# EAGLE design spine (EAGLE 6.5.0)

## Sheet 1 of 3: Leg COM
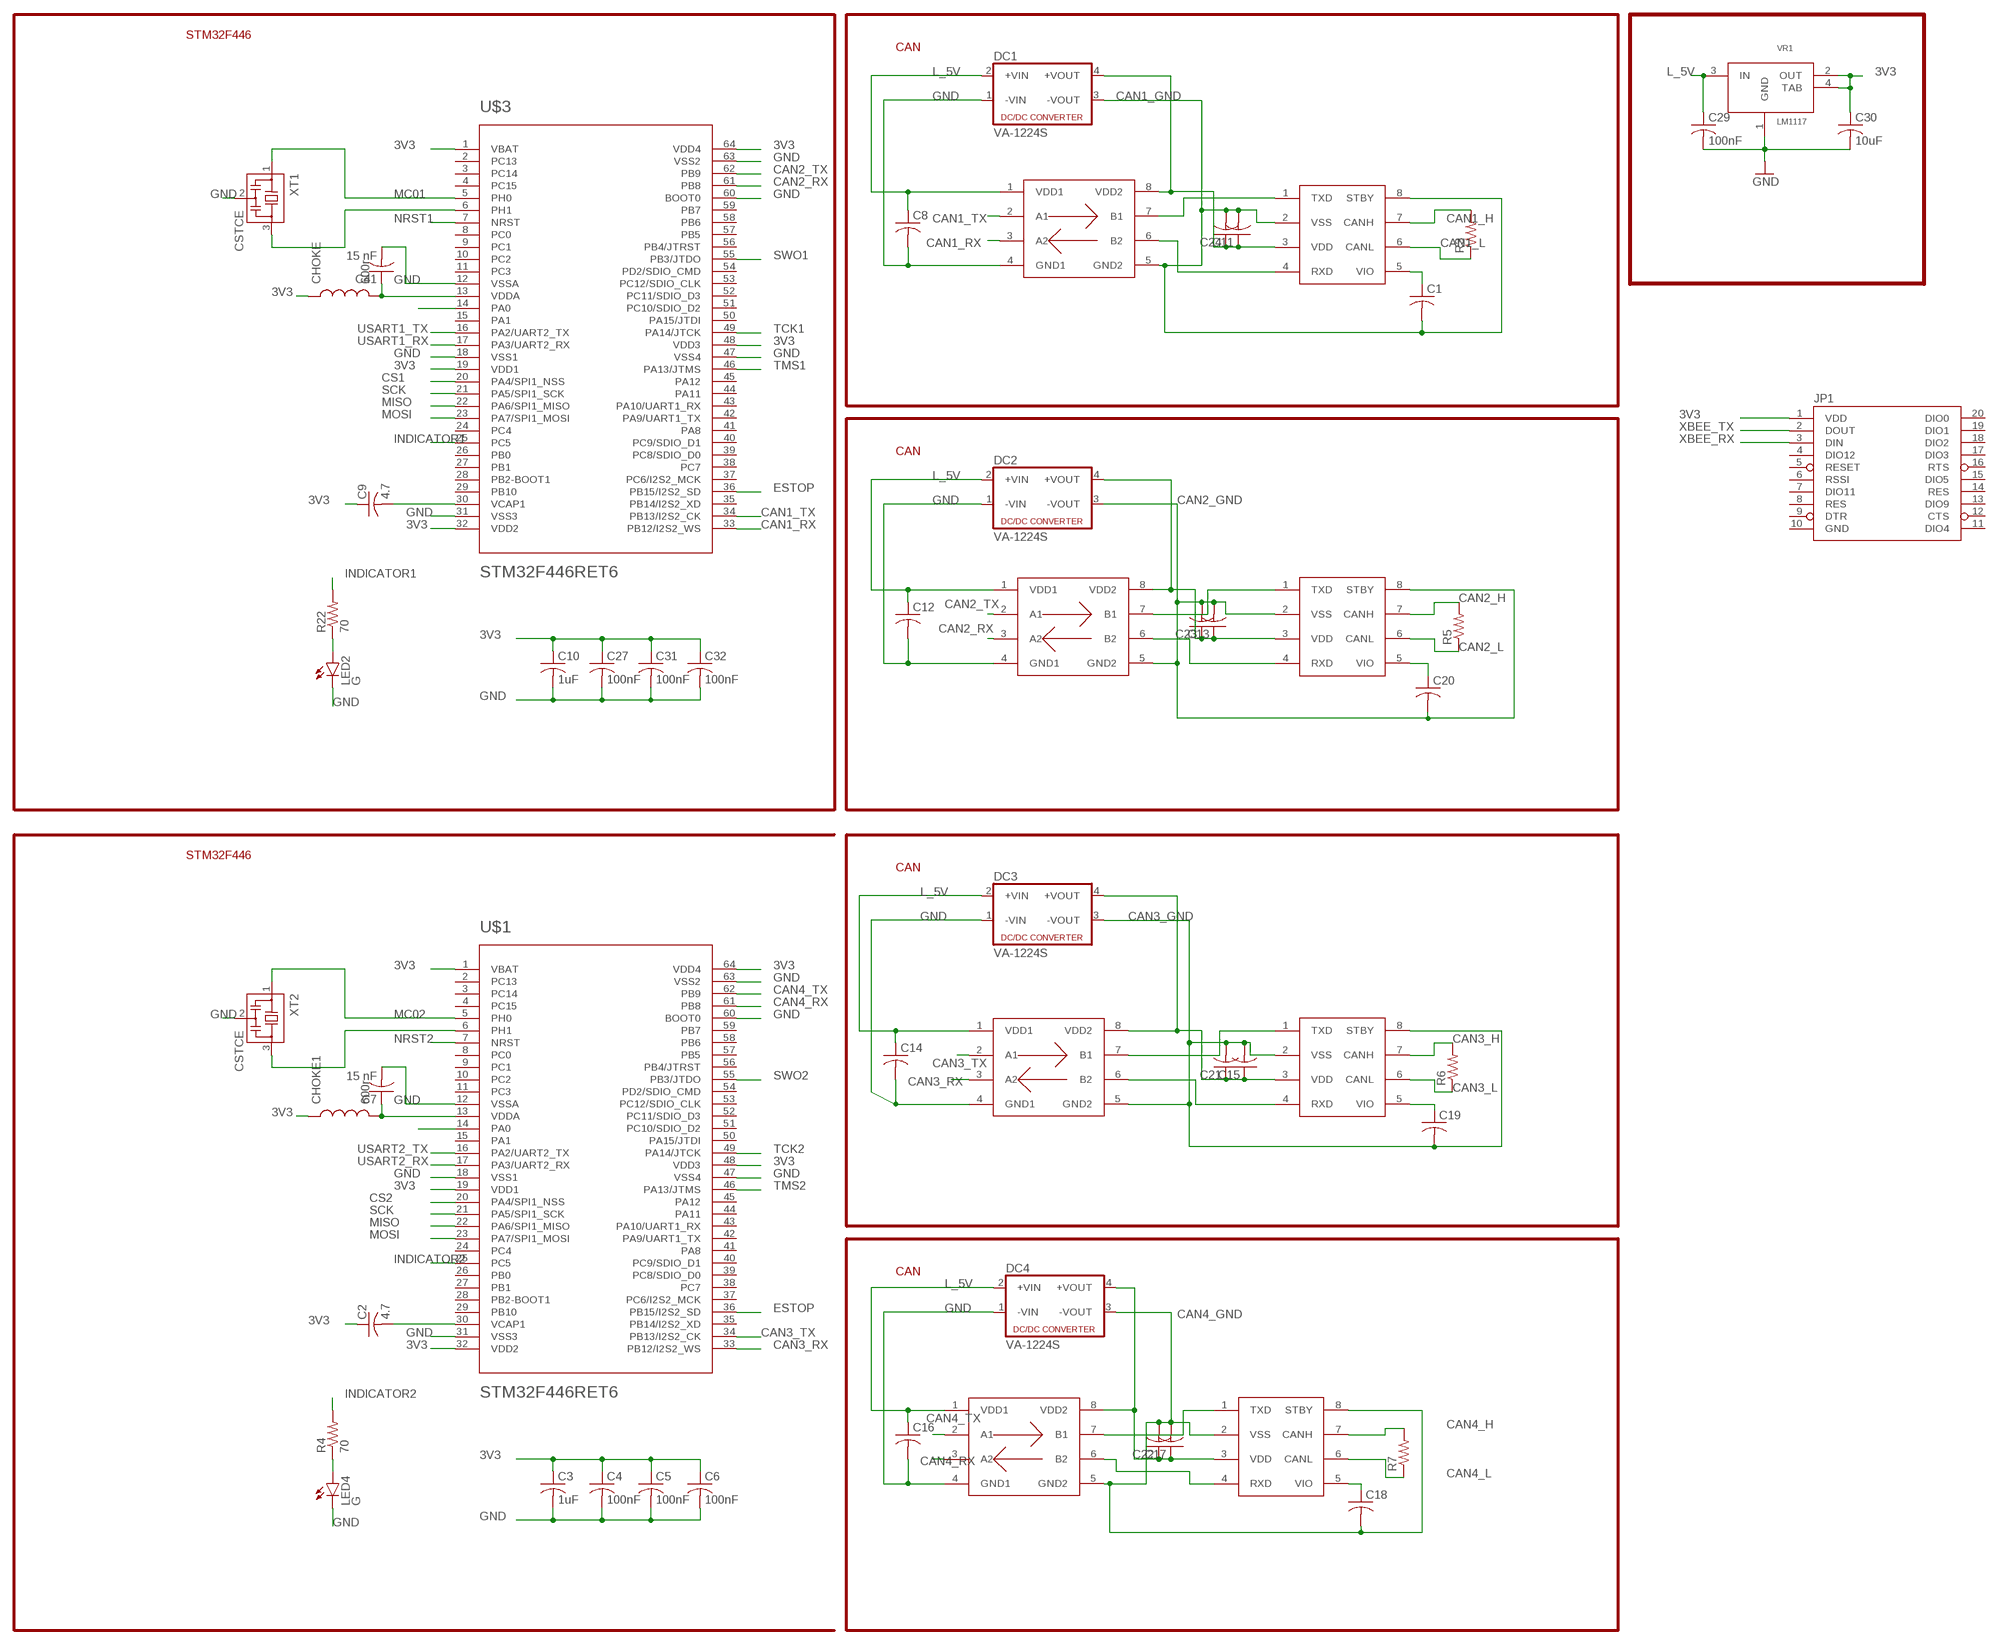
[diagram p0: schematic, sheet 1]

### Parts
C1  C-USC0603K  [C0603K]
C2  4.7  C-USC0603  [C0603]
C3  1uF  C-USC0603  [C0603]
C4  100nF  C-USC0603  [C0603]
C5  100nF  C-USC0603  [C0603]
C6  100nF  C-USC0603  [C0603]
C7  15 nF  C-USC0603  [C0603]
C8  C-USC0603K  [C0603K]
C9  4.7  C-USC0603  [C0603]
C10  1uF  C-USC0603  [C0603]
C11  C-USC0603K  [C0603K]
C12  C-USC0603K  [C0603K]
C13  C-USC0603K  [C0603K]
C14  C-USC0603K  [C0603K]
C15  C-USC0603K  [C0603K]
C16  C-USC0603K  [C0603K]
C17  C-USC0603K  [C0603K]
C18  C-USC0603K  [C0603K]
C19  C-USC0603K  [C0603K]
C20  C-USC0603K  [C0603K]
C21  C-USC0603K  [C0603K]
C22  C-USC0603K  [C0603K]
C23  C-USC0603K  [C0603K]
C24  C-USC0603K  [C0603K]
C27  100nF  C-USC0603  [C0603]
C29  100nF  C-USC0603  [C0603]
C30  10uF  C-USC0805K  [C0805K]
C31  100nF  C-USC0603  [C0603]
C32  100nF  C-USC0603  [C0603]
C41  15 nF  C-USC0603  [C0603]
CHOKE  600r  INDUCTOR0603  [0603]
CHOKE1  600r  INDUCTOR0603  [0603]
DC1  VA-1224S  [4SIL]
DC2  VA-1224S  [4SIL]
DC3  VA-1224S  [4SIL]
DC4  VA-1224S  [4SIL]
JP1  XBEE-1B1  [XBEE-1]
LED2  G  LED0603  [LED-0603]
LED4  G  LED0603  [LED-0603]
R3  R-US_R0603  [R0603]
R4  70  R-US_R0603  [R0603]
R5  R-US_R0603  [R0603]
R6  R-US_R0603  [R0603]
R7  R-US_R0603  [R0603]
R22  70  R-US_R0603  [R0603]
U$1  STM32F446RET6  [TQFP64]
U$3  STM32F446RET6  [TQFP64]
U$4  MCP2561  [SO08]
U$5  MCP2561  [SO08]
U$6  MCP2561  [SO08]
U$7  MCP2561  [SO08]
U$8  SI8410  [SO08]
U$9  SI8410  [SO08]
U$10  SI8410  [SO08]
U$11  SI8410  [SO08]
VR1  LM1117  [SOT-223]
XT1  CSTCE  [CSTCE]
XT2  CSTCE  [CSTCE]

### Nets
3V3: C2.1 C3.1 C4.1 C5.1 C6.1 C9.1 C10.1 C27.1 C30.1 C31.1 C32.1 CHOKE1.1 CHOKE.1 JP1.1(VDD) U$1.1(VBAT) U$1.19(VDD1) U$1.32(VDD2) U$1.48(VDD3) U$1.64(VDD4) U$3.1(VBAT) U$3.19(VDD1) U$3.32(VDD2) U$3.48(VDD3) U$3.64(VDD4) VR1.2(OUT) VR1.4(TAB) ; also sheet 2
CAN1_GND: C1.2 C11.2 C24.2 DC1.3(-VOUT) U$4.2(VSS) U$4.8(STBY) U$8.5(GND2) ; also sheet 2
CAN1_H: R3.2 U$4.7(CANH) ; also sheet 2
CAN1_L: R3.1 U$4.6(CANL) ; also sheet 2
CAN1_RX: U$3.33(PB12/I2S2_WS) U$8.3(A2)
CAN1_TX: U$3.34(PB13/I2S2_CK) U$8.2(A1)
CAN2_GND: C13.2 C20.2 C23.2 DC2.3(-VOUT) U$5.2(VSS) U$5.8(STBY) U$10.5(GND2) ; also sheet 2
CAN2_H: R5.2 U$5.7(CANH) ; also sheet 2
CAN2_L: R5.1 U$5.6(CANL) ; also sheet 2
CAN2_RX: U$3.61(PB8) U$10.3(A2)
CAN2_TX: U$3.62(PB9) U$10.2(A1)
CAN3_GND: C15.2 C19.2 C21.2 DC3.3(-VOUT) U$6.2(VSS) U$6.8(STBY) U$9.5(GND2) ; also sheet 2
CAN3_H: R6.2 U$6.7(CANH) ; also sheet 2
CAN3_L: R6.1 U$6.6(CANL) ; also sheet 2
CAN3_RX: U$1.33(PB12/I2S2_WS) U$9.3(A2)
CAN3_TX: U$1.34(PB13/I2S2_CK) U$9.2(A1)
CAN4_GND: C17.2 C18.2 C22.2 DC4.3(-VOUT) U$7.2(VSS) U$7.8(STBY) U$11.5(GND2) ; also sheet 2
CAN4_H: R7.2 U$7.7(CANH) ; also sheet 2
CAN4_L: R7.1 U$7.6(CANL) ; also sheet 2
CAN4_RX: U$1.61(PB8) U$11.3(A2)
CAN4_TX: U$1.62(PB9) U$11.2(A1)
CS1: U$3.20(PA4/SPI1_NSS) ; also sheet 3
CS2: U$1.20(PA4/SPI1_NSS) ; also sheet 3
ESTOP: U$1.36(PB15/I2S2_SD) U$3.36(PB15/I2S2_SD) ; also sheet 2
GND: C3.2 C4.2 C5.2 C6.2 C7.2 C8.2 C10.2 C12.2 C14.2 C16.2 C27.2 C29.2 C30.2 C31.2 C32.2 C41.2 DC1.1(-VIN) DC2.1(-VIN) DC3.1(-VIN) DC4.1(-VIN) LED2.C LED4.C U$1.12(VSSA) U$1.18(VSS1) U$1.31(VSS3) U$1.47(VSS4) U$1.60(BOOT0) U$1.63(VSS2) U$3.12(VSSA) U$3.18(VSS1) U$3.31(VSS3) U$3.47(VSS4) U$3.60(BOOT0) U$3.63(VSS2) U$8.4(GND1) U$9.4(GND1) U$10.4(GND1) U$11.4(GND1) VR1.1(GND) XT1.2 XT2.2 ; also sheet 2,3
INDICATOR1: R22.2 U$3.25(PC5)
INDICATOR2: R4.2 U$1.25(PC5)
L_5V: C8.1 C12.1 C14.1 C16.1 C29.1 DC1.2(+VIN) DC2.2(+VIN) DC3.2(+VIN) DC4.2(+VIN) U$8.1(VDD1) U$9.1(VDD1) U$10.1(VDD1) U$11.1(VDD1) VR1.3(IN) ; also sheet 2,3
MC01: U$3.5(PH0) XT1.1
MC02: U$1.5(PH0) XT2.1
MISO: U$1.22(PA6/SPI1_MISO) U$3.22(PA6/SPI1_MISO) ; also sheet 3
MOSI: U$1.23(PA7/SPI1_MOSI) U$3.23(PA7/SPI1_MOSI) ; also sheet 3
N$1: U$1.14(PA0)
N$2: C41.1 CHOKE.2 U$3.13(VDDA)
N$3: C9.2 U$3.30(VCAP1)
N$4: C7.1 CHOKE1.2 U$1.13(VDDA)
N$5: C2.2 U$1.30(VCAP1)
N$6: C1.1 U$4.5(VIO)
N$7: LED4.A R4.1
N$8: U$1.6(PH1) XT2.3
N$9: C17.1 C22.1 DC4.4(+VOUT) U$7.3(VDD) U$11.8(VDD2)
N$10: C20.1 U$5.5(VIO)
N$11: C15.1 C21.1 DC3.4(+VOUT) U$6.3(VDD) U$9.8(VDD2)
N$12: C11.1 C24.1 DC1.4(+VOUT) U$4.3(VDD) U$8.8(VDD2)
N$14: U$4.1(TXD) U$8.7(B1)
N$15: U$7.1(TXD) U$11.7(B1)
N$16: U$4.4(RXD) U$8.6(B2)
N$17: U$7.4(RXD) U$11.6(B2)
N$18: C18.1 U$7.5(VIO)
N$19: C13.1 C23.1 DC2.4(+VOUT) U$5.3(VDD) U$10.8(VDD2)
N$20: U$5.1(TXD) U$10.7(B1)
N$21: U$5.4(RXD) U$10.6(B2)
N$22: C19.1 U$6.5(VIO)
N$24: U$3.14(PA0)
N$26: U$6.1(TXD) U$9.7(B1)
N$27: U$6.4(RXD) U$9.6(B2)
N$28: LED2.A R22.1
N$30: U$3.6(PH1) XT1.3
NRST1: U$3.7(NRST) ; also sheet 2
NRST2: U$1.7(NRST) ; also sheet 2
SCK: U$1.21(PA5/SPI1_SCK) U$3.21(PA5/SPI1_SCK) ; also sheet 3
SWO1: U$3.55(PB3/JTDO) ; also sheet 2
SWO2: U$1.55(PB3/JTDO) ; also sheet 2
TCK1: U$3.49(PA14/JTCK) ; also sheet 2
TCK2: U$1.49(PA14/JTCK) ; also sheet 2
TMS1: U$3.46(PA13/JTMS) ; also sheet 2
TMS2: U$1.46(PA13/JTMS) ; also sheet 2
USART1_RX: U$3.17(PA3/UART2_RX) ; also sheet 2
USART1_TX: U$3.16(PA2/UART2_TX) ; also sheet 2
USART2_RX: U$1.17(PA3/UART2_RX) ; also sheet 2
USART2_TX: U$1.16(PA2/UART2_TX) ; also sheet 2
XBEE_RX: JP1.3(DIN) ; also sheet 3
XBEE_TX: JP1.2(DOUT) ; also sheet 3
Unconnected: JP1.4(DIO12) JP1.5(RESET) JP1.6(RSSI) JP1.7(DIO11) JP1.8(RES) JP1.9(DTR) JP1.11(DIO4) JP1.12(CTS) JP1.13(DIO9) JP1.14(RES) JP1.15(DIO5) JP1.16(RTS) JP1.17(DIO3) JP1.18(DIO2) JP1.19(DIO1) JP1.20(DIO0) U$1.2(PC13) U$1.3(PC14) U$1.4(PC15) U$1.8(PC0) U$1.9(PC1) U$1.10(PC2) U$1.11(PC3) U$1.15(PA1) U$1.24(PC4) U$1.26(PB0) U$1.27(PB1) U$1.28(PB2-BOOT1) U$1.29(PB10) U$1.35(PB14/I2S2_XD) U$1.37(PC6/I2S2_MCK) U$1.38(PC7) U$1.39(PC8/SDIO_D0) U$1.40(PC9/SDIO_D1) U$1.41(PA8) U$1.42(PA9/UART1_TX) U$1.43(PA10/UART1_RX) U$1.44(PA11) U$1.45(PA12) U$1.50(PA15/JTDI) U$1.51(PC10/SDIO_D2) U$1.52(PC11/SDIO_D3) U$1.53(PC12/SDIO_CLK) U$1.54(PD2/SDIO_CMD) U$1.56(PB4/JTRST) U$1.57(PB5) U$1.58(PB6) U$1.59(PB7) U$3.2(PC13) U$3.3(PC14) U$3.4(PC15) U$3.8(PC0) U$3.9(PC1) U$3.10(PC2) U$3.11(PC3) U$3.15(PA1) U$3.24(PC4) U$3.26(PB0) U$3.27(PB1) U$3.28(PB2-BOOT1) U$3.29(PB10) U$3.35(PB14/I2S2_XD) U$3.37(PC6/I2S2_MCK) U$3.38(PC7) U$3.39(PC8/SDIO_D0) U$3.40(PC9/SDIO_D1) U$3.41(PA8) U$3.42(PA9/UART1_TX) U$3.43(PA10/UART1_RX) U$3.44(PA11) U$3.45(PA12) U$3.50(PA15/JTDI) U$3.51(PC10/SDIO_D2) U$3.52(PC11/SDIO_D3) U$3.53(PC12/SDIO_CLK) U$3.54(PD2/SDIO_CMD) U$3.56(PB4/JTRST) U$3.57(PB5) U$3.58(PB6) U$3.59(PB7)

### Notes on the sheet
- STM32F446
- CAN
- CAN
- STM32F446
- CAN
- CAN

## Sheet 2 of 3: Connectors
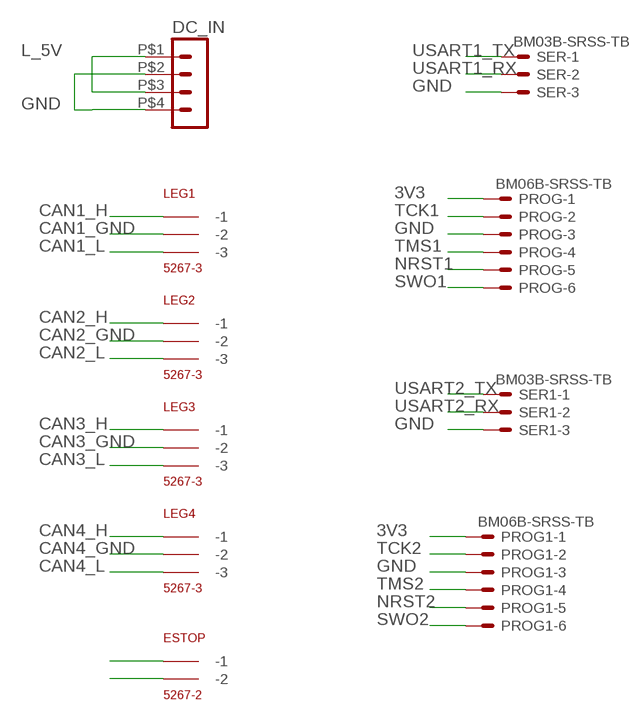
[diagram p1: schematic, sheet 2]

### Parts
DC_IN  HEADER_POS4_43045-0401  [43045-0400]
ESTOP  5267-2  [5267-2]
LEG1  5267-3  [5267-3]
LEG2  5267-3  [5267-3]
LEG3  5267-3  [5267-3]
LEG4  5267-3  [5267-3]
PROG  BM06B-SRSS-TB  [BM06B-SRSS-TB]
PROG1  BM06B-SRSS-TB  [BM06B-SRSS-TB]
SER  BM03B-SRSS-TB  [BM03B-SRSS-TB]
SER1  BM03B-SRSS-TB  [BM03B-SRSS-TB]

### Nets
3V3: PROG1.1 PROG.1 ; also sheet 1
CAN1_GND: LEG1.P$2(-2) ; also sheet 1
CAN1_H: LEG1.P$1(-1) ; also sheet 1
CAN1_L: LEG1.P$3(-3) ; also sheet 1
CAN2_GND: LEG2.P$2(-2) ; also sheet 1
CAN2_H: LEG2.P$1(-1) ; also sheet 1
CAN2_L: LEG2.P$3(-3) ; also sheet 1
CAN3_GND: LEG3.P$2(-2) ; also sheet 1
CAN3_H: LEG3.P$1(-1) ; also sheet 1
CAN3_L: LEG3.P$3(-3) ; also sheet 1
CAN4_GND: LEG4.P$2(-2) ; also sheet 1
CAN4_H: LEG4.P$1(-1) ; also sheet 1
CAN4_L: LEG4.P$3(-3) ; also sheet 1
ESTOP: ESTOP.P$2(-2) ; also sheet 1
GND: DC_IN.P$2 DC_IN.P$4 ESTOP.P$1(-1) PROG1.3 PROG.3 SER1.3 SER.3 ; also sheet 1,3
L_5V: DC_IN.P$1 DC_IN.P$3 ; also sheet 1,3
NRST1: PROG.5 ; also sheet 1
NRST2: PROG1.5 ; also sheet 1
SWO1: PROG.6 ; also sheet 1
SWO2: PROG1.6 ; also sheet 1
TCK1: PROG.2 ; also sheet 1
TCK2: PROG1.2 ; also sheet 1
TMS1: PROG.4 ; also sheet 1
TMS2: PROG1.4 ; also sheet 1
USART1_RX: SER.2 ; also sheet 1
USART1_TX: SER.1 ; also sheet 1
USART2_RX: SER1.2 ; also sheet 1
USART2_TX: SER1.1 ; also sheet 1

## Sheet 3 of 3: UP Board
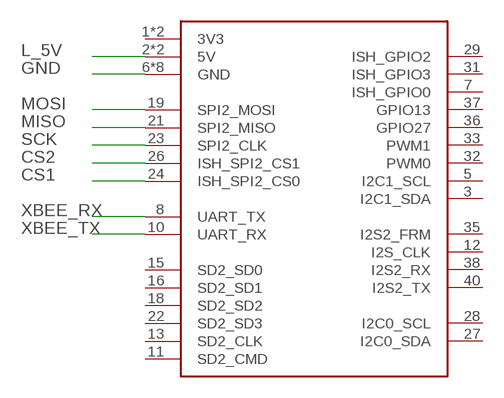
[diagram p2: schematic, sheet 3]

### Parts
U$2  UP_BOARD  [UP_BOARD]

### Nets
CS1: U$2.24(ISH_SPI2_CS0) ; also sheet 1
CS2: U$2.26(ISH_SPI2_CS1) ; also sheet 1
GND: U$2.6(GND) U$2.9(GND) U$2.14(GND) U$2.20(GND) U$2.25(GND) U$2.30(GND) U$2.34(GND) U$2.39(GND) ; also sheet 1,2
L_5V: U$2.2(5V) U$2.4(5V) ; also sheet 1,2
MISO: U$2.21(SPI2_MISO) ; also sheet 1
MOSI: U$2.19(SPI2_MOSI) ; also sheet 1
SCK: U$2.23(SPI2_CLK) ; also sheet 1
XBEE_RX: U$2.8(UART_TX) ; also sheet 1
XBEE_TX: U$2.10(UART_RX) ; also sheet 1
Unconnected: U$2.1(3V3) U$2.3(I2C1_SDA) U$2.5(I2C1_SCL) U$2.7(ISH_GPIO0) U$2.11(SD2_CMD) U$2.12(I2S_CLK) U$2.13(SD2_CLK) U$2.15(SD2_SD0) U$2.16(SD2_SD1) U$2.17(3V3) U$2.18(SD2_SD2) U$2.22(SD2_SD3) U$2.27(I2C0_SDA) U$2.28(I2C0_SCL) U$2.29(ISH_GPIO2) U$2.31(ISH_GPIO3) U$2.32(PWM0) U$2.33(PWM1) U$2.35(I2S2_FRM) U$2.36(GPIO27) U$2.37(GPIO13) U$2.38(I2S2_RX) U$2.40(I2S2_TX)

## Power pins joined to a net without a drawn wire
GND: JP1.10(GND)

## Library data of the parts
C1-C24 C27 C29-C32 C41 = rcl:C-US: CAPACITOR, American symbol
CHOKE CHOKE1 = SparkFun-Passives:INDUCTOR: Inductors Basic Inductor/Choke - 0603 and 1206. Footprints are not proven and vary greatly between part numbers. INDUCTOR POWER 3.3UH 4.0A SMD 0.197" L x 0.197" W x 0.177" H (5.00mm x 5.00mm x 4.50mm)
DC1-DC4 = dc-dc-converter:VA-*?: DC DC Converter Single Output, 1 Watt Motien Technology Co.,Ltd. Source: va-serie.pdf
DC_IN = con-molex-micro-fit-3_0:HEADER_POS4_?: Molex - Micro-Fit 3.0 Series connector, 3.00mm (0.118") pitch header, 4 positions.
ESTOP = con-molex-spox:5267-2
JP1 = SparkFun-RF:XBEE-1: Xbee module footprints
LED2 LED4 = SparkFun-LED:LED: LEDs Standard schematic elements and footprints for 5mm, 3mm, 1206, and 0603 sized LEDs. 5mm - Spark Fun Electronics SKU : COM-00529 (and others)
LEG1-LEG4 = con-molex-spox:5267-3
PROG PROG1 = con-jst2:?M06B-SRSS-TB: Disconnectable Crimp style connector, 1.0mm pitch 6 contacts
R3-R7 R22 = rcl:R-US_: RESISTOR, American symbol
SER SER1 = con-jst2:?M03B-SRSS-TB: Disconnectable Crimp style connector, 1.0mm pitch 3 contacts
U$1 U$3 = BenLibrary:STM32F446RET6: ARM DSP Chip used on the WAV Trigger board.
U$2 = BenLibrary:UP_BOARD
U$4-U$7 = BenLibrary:MCP2561
U$8-U$11 = BenLibrary:SI8410
VR1 = sc_usercreated:LM1117
XT1 XT2 = sc_usercreated:CSTCE

## Board
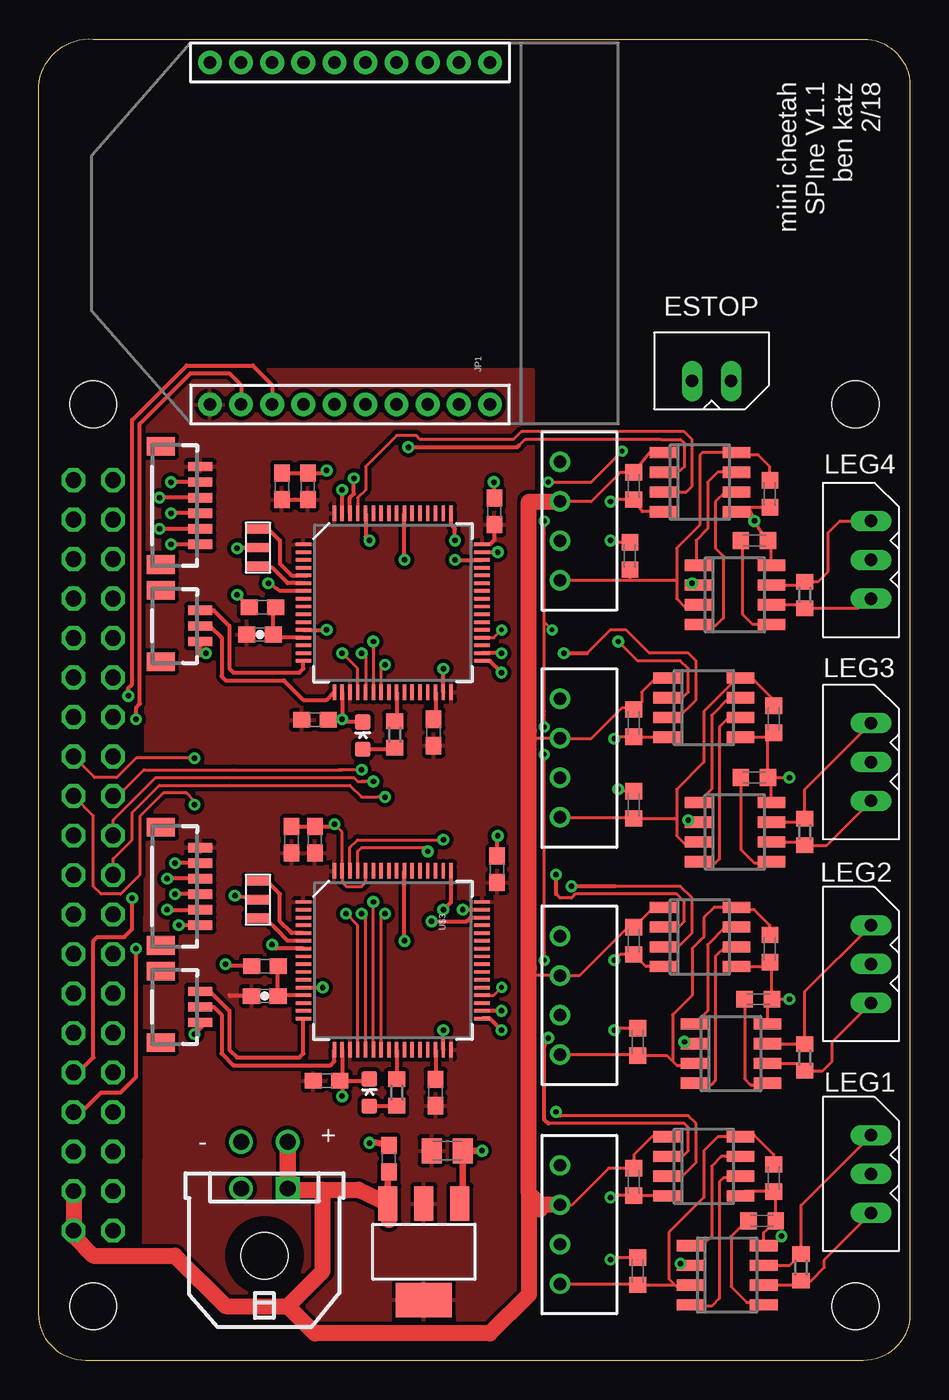
[diagram p3: board, top side]
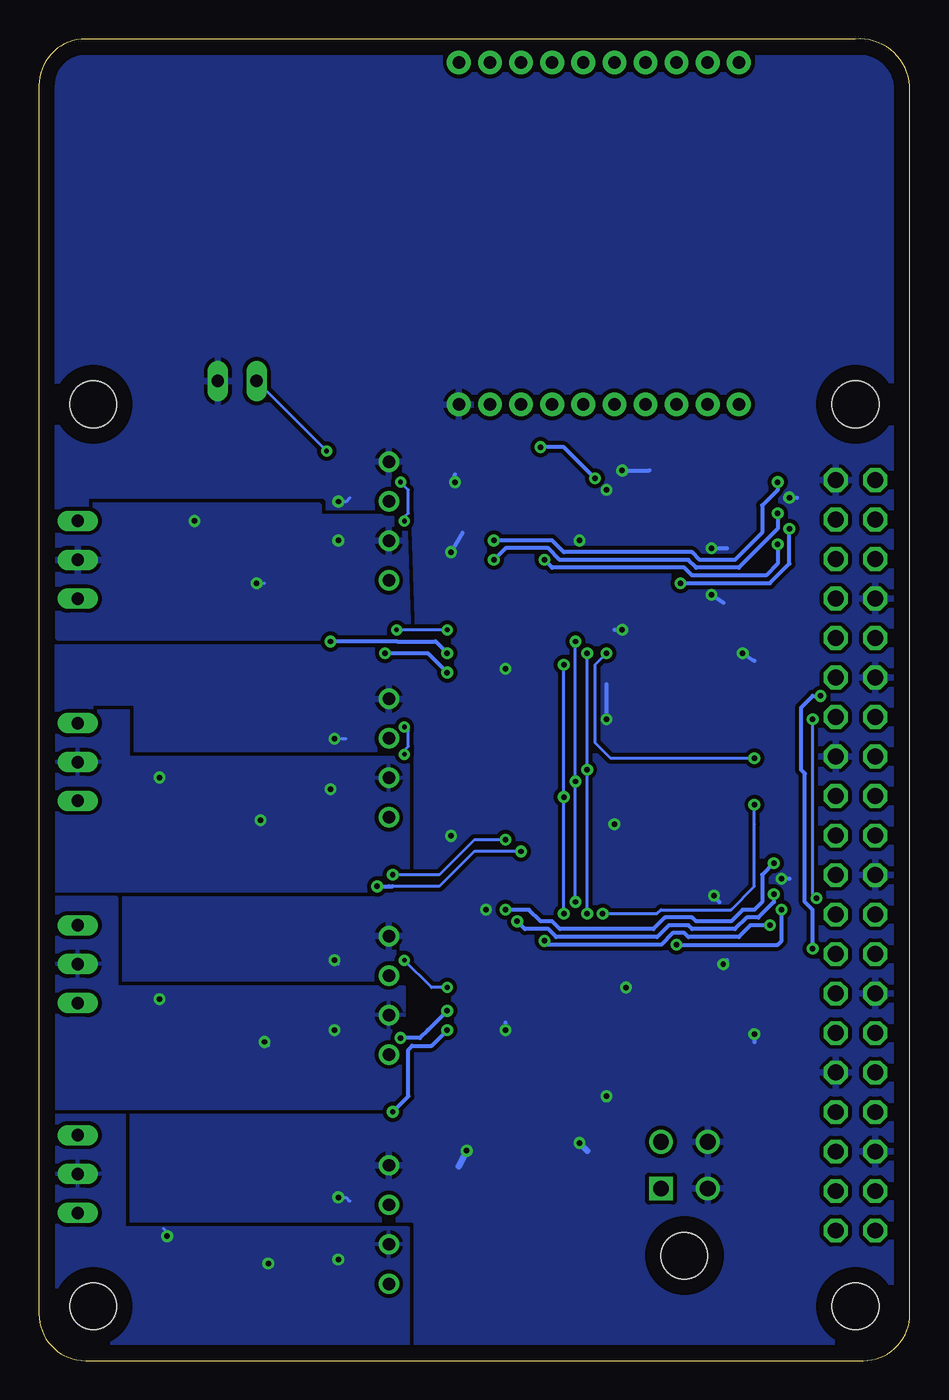
[diagram p4: board, bottom side, seen from below]

Size 56 x 85.01 mm. Coordinates in mm from the lower left corner, seen from the top.
Copper layers (1*16): Top 0.035mm / dielectric 1.5mm / Bottom 0.035mm
Design rules "default *": minimum track width 6mil, minimum drill 0.3mm, track to track 6mil, track to pad 6mil, pad to pad 6mil, via to via 6mil, smd to smd 6mil, copper to edge 40mil, drill to drill 6mil, minimum pad ring 10mil, minimum via ring 8mil, stop-mask expansion 4mil, vias tented up to drill 0mil, thermal gap 10mil

### Footprints (pad centres in the part's own frame; a part is rotated, then mirrored left to right if it is on the bottom)
C0603K = smd 1.05 x 1.08: 1 -0.875,0; 2 0.875,0
C0603 = smd 1.1 x 1: 1 -0.85,0; 2 0.85,0
C0805K = smd 1.3 x 1.6: 1 -1,0; 2 1,0
0603 = smd 1.1 x 1: 1 -0.85,0; 2 0.85,0
4SIL = drill 0.8: 1 -3.81,0; 2 -1.27,0; 3 1.27,0; 4 3.81,0
43045-0400 = drill 1.02 square: P$1 1.5,4.32 | drill 1.02: P$2 -1.5,4.32; P$3 1.5,7.32; P$4 -1.5,7.32 | hole 3: 0,0
5267-2 = drill 0.8 long: P$1 0,0; P$2 2.5,0
XBEE-1 = drill 0.8 pad 1.524: 1 -11,20; 2 -11,18; 3 -11,16; 4 -11,14; 5 -11,12; 6 -11,10; 7 -11,8; 8 -11,6; 9 -11,4; 10 -11,2; 11 11,2; 12 11,4; 13 11,6; 14 11,8; 15 11,10; 16 11,12; 17 11,14; 18 11,16; 19 11,18; 20 11,20
LED-0603 = smd 1 x 1: A 0,-0.877; C 0,0.877
5267-3 = drill 0.8 long: P$1 0,0; P$2 2.5,0; P$3 5,0
BM06B-SRSS-TB = smd 0.6 x 1.55: 1 2.5,-1.625; 2 1.5,-1.625; 3 0.5,-1.625; 4 -0.5,-1.625; 5 -1.5,-1.625; 6 -2.5,-1.625 | smd 1.2 x 1.8: FIT@1 3.8,0.9; FIT@2 -3.8,0.9
R0603 = smd 1 x 1.1: 1 -0.85,0; 2 0.85,0
BM03B-SRSS-TB = smd 0.6 x 1.55: 1 1,-1.625; 2 0,-1.625; 3 -1,-1.625 | smd 1.2 x 1.8: FIT@1 2.3,0.9; FIT@2 -2.3,0.9
TQFP64 = smd 0.22 x 1: 1 -3.75,-5.75; 2 -3.25,-5.75; 3 -2.75,-5.75; 4 -2.25,-5.75; 5 -1.75,-5.75; 6 -1.25,-5.75; 7 -0.75,-5.75; 8 -0.25,-5.75; 9 0.25,-5.75; 10 0.75,-5.75; 11 1.25,-5.75; 12 1.75,-5.75; 13 2.25,-5.75; 14 2.75,-5.75; 15 3.25,-5.75; 16 3.75,-5.75; 33 3.75,5.75; 34 3.25,5.75; 35 2.75,5.75; 36 2.25,5.75; 37 1.75,5.75; 38 1.25,5.75; 39 0.75,5.75; 40 0.25,5.75; 41 -0.25,5.75; 42 -0.75,5.75; 43 -1.25,5.75; 44 -1.75,5.75; 45 -2.25,5.75; 46 -2.75,5.75; 47 -3.25,5.75; 48 -3.75,5.75 | smd 1 x 0.22: 17 5.75,-3.75; 18 5.75,-3.25; 19 5.75,-2.75; 20 5.75,-2.25; 21 5.75,-1.75; 22 5.75,-1.25; 23 5.75,-0.75; 24 5.75,-0.25; 25 5.75,0.25; 26 5.75,0.75; 27 5.75,1.25; 28 5.75,1.75; 29 5.75,2.25; 30 5.75,2.75; 31 5.75,3.25; 32 5.75,3.75; 49 -5.75,3.75; 50 -5.75,3.25; 51 -5.75,2.75; 52 -5.75,2.25; 53 -5.75,1.75; 54 -5.75,1.25; 55 -5.75,0.75; 56 -5.75,0.25; 57 -5.75,-0.25; 58 -5.75,-0.75; 59 -5.75,-1.25; 60 -5.75,-1.75; 61 -5.75,-2.25; 62 -5.75,-2.75; 63 -5.75,-3.25; 64 -5.75,-3.75
UP_BOARD = drill 1.016 octagon: 1 8.37,51.23; 2 8.37,53.77; 3 10.91,51.23; 4 10.91,53.77; 5 13.45,51.23; 6 13.45,53.77; 7 15.99,51.23; 8 15.99,53.77; 9 18.53,51.23; 10 18.53,53.77; 11 21.07,51.23; 12 21.07,53.77; 13 23.61,51.23; 14 23.61,53.77; 15 26.15,51.23; 16 26.15,53.77; 17 28.69,51.23; 18 28.69,53.77; 19 31.23,51.23; 20 31.23,53.77; 21 33.77,51.23; 22 33.77,53.77; 23 36.31,51.23; 24 36.31,53.77; 25 38.85,51.23; 26 38.85,53.77; 27 41.39,51.23; 28 41.39,53.77; 29 43.93,51.23; 30 43.93,53.77; 31 46.47,51.23; 32 46.47,53.77; 33 49.01,51.23; 34 49.01,53.77; 35 51.55,51.23; 36 51.55,53.77; 37 54.09,51.23; 38 54.09,53.77; 39 56.63,51.23; 40 56.63,53.77 | hole 3: 3.5,52.5; 61.5,52.5; 61.5,3.5; 3.5,3.5
SO08 = smd 0.72 x 1.78: 1 -1.905,-2.35; 2 -0.635,-2.35; 3 0.635,-2.35; 4 1.905,-2.35; 5 1.905,2.35; 6 0.635,2.35; 7 -0.635,2.35; 8 -1.905,2.35
SOT-223 = smd 1.219 x 2.235: 1 -2.311,-3.099; 2 0,-3.099; 3 2.311,-3.099 | smd 3.6 x 2.2: 4 0,3.099
CSTCE = smd 0.6 x 1.6: 1 -1.2,0; 2 0,0; 3 1.2,0

### Placement (x,y rotation side)
C1  46.5,9 0 top
C2  25.38,40.4 90 top
C3  15.63,56.23 90 top
C4  17.29,56.24 90 top
C5  29.29,54.62 90 top
C6  17.75,41.21 0 top
C7  14.37,48.46 180 top
C8  38.25,11.5 270 top
C9  25.5,17.25 90 top
C10  16.25,33.5 90 top
C11  38.5,5.75 90 top
C12  38.25,27 270 top
C13  38.5,20.5 90 top
C14  38.25,41 270 top
C15  38.25,35.75 90 top
C16  38.25,56.25 270 top
C17  38,51.75 90 top
C18  46,52.75 0 top
C19  46,37.5 0 top
C20  46.25,23.25 0 top
C21  47.25,41.25 270 top
C22  47,55.75 270 top
C23  47,26.5 270 top
C24  47.25,11.75 270 top
C27  17.75,33.5 90 top
C29  22.5,13 90 top
C30  26.25,13.5 0 top
C31  29.46,31.6 90 top
C32  18.5,18 0 top
C41  14.53,25.38 180 top
CHOKE  14.52,23.45 0 top
CHOKE1  14.21,46.7 0 top
DC1  33.5,8.75 270 top
DC2  33.5,23.5 270 top
DC3  33.5,38.75 270 top
DC4  33.5,54 270 top
DC_IN  14.5,6.75 0 top
ESTOP  44.5,63 180 top
JP1  31,72.5 90 top
LED2  21.25,17.25 0 top
LED4  20.83,40.2 0 top
LEG1  53.5,14.5 270 top
LEG2  53.5,28 270 top
LEG3  53.5,41 270 top
LEG4  53.5,54 270 top
PROG  8.75,30.5 90 top
PROG1  8.75,55 90 top
R3  49,6 90 top
R4  22.88,40.26 90 top
R5  49.25,19.5 90 top
R6  49.25,34 90 top
R7  49.25,49.25 90 top
R22  23,17.25 90 top
SER  8.75,22.75 90 top
SER1  8.75,47.25 90 top
U$1  22.75,48.75 270 top
U$2  56,0 90 top
U$3  22.75,25.75 270 top
U$4  44.25,5.5 270 top
U$5  44.5,19.75 270 top
U$6  44.75,34 270 top
U$7  44.75,49.25 270 top
U$8  42.75,12.5 270 top
U$9  42.75,42 270 top
U$10  42.5,27.25 270 top
U$11  42.5,56.5 270 top
VR1  24.75,7 180 top
XT1  14.09,29.65 270 top
XT2  14.09,52.29 270 top

### Tracks (layer width: path | path; a pad name or v marks a point on that pad's centre or on a via)
3V3
  Top 0.25: C3.1 C4.1 | C5.1 29.29,52.79 29,52.5 U$1.48 | CHOKE.1 12.3,23.45 12.25,23.5
  pour Top (isolate 0.25): 7,63.75 31.75,63.75 31.75,1.25 6.75,1.25
CAN1_GND  (via drill 0.35)
  Top 0.2: U$8.5 45.38,10.88 C24.2 47.38,10.75 C1.2 46.6,8.22 U$4.8 47.16,7.41 v47.75,8 | U$4.2 41.37,6.13 v41.25,6.25 | C11.2 36.88,6.62 v36.75,6.5
  Bottom 0.2: v47.75,8 47.75,8.25 48,8.5 | v41.25,6.25 41,6.25 | v36.75,6.5 36.5,6.5
  pour Bottom (isolate 0.254): 32.25,8.5 50.5,8.5 50.5,15.75 55,15.75 55,1 32.25,1
CAN1_H
  Top 0.2: U$4.7 48.28,6.13 R3.2 49,10 LEG1.P$1
CAN1_L
  Top 0.2: U$4.6 48.72,4.87 R3.1 49.65,5.15 50.5,6 50.5,6.5 LEG1.P$3
CAN1_RX  (via drill 0.35)
  Top 0.2: U$8.3 41.37,11.87 42.25,12.75 42.25,15.25 41.75,15.75 33.5,15.75 v33.25,16
  Top 0.25: 33.5,15.75 v33.25,16 | v29.75,21.25 29,22 U$3.33
  Bottom 0.25: v33.25,16 32.25,17 32.25,20 32,20.25 30.75,20.25 v29.75,21.25
CAN1_TX  (via drill 0.35)
  Top 0.2: U$8.2 41.38,13.13 41.75,13.5 41.75,15 41.5,15.25 32.75,15.25
  Top 0.25: 32.75,15.25 32.5,15.5 32.5,20.25 v32.75,20.75 | v29.75,22.5 U$3.34
  Bottom 0.25: v29.75,22.5 31,21.25 31.5,20.75 v32.75,20.75
CAN2_GND  (via drill 0.35)
  Top 0.2: C13.2 37.12,21.38 v37,21.25 | U$5.2 41.62,20.39 v41.5,20.5 | U$10.5 46.72,25.34 C23.2 47.12,25.5 C20.2 46.85,22.98 U$5.8 46.85,23.1 47,23.25 v48.25,23.25
  Bottom 0.2: v37,21.25 37,21.5 | v41.5,20.5 41.25,20.25 | v48.25,23.25 48.5,23.25
  pour Bottom (isolate 0.254): 32.5,24 51,24 51,29.75 55,29.75 55,16.25 32.5,16.25
CAN2_H
  Top 0.2: U$5.7 49.22,20.39 R5.2 49.25,23.75 LEG2.P$1
CAN2_L
  Top 0.2: U$5.6 48.78,19.11 R5.1 50.4,18.65 51,19.25 51,20.5 LEG2.P$3
CAN2_RX  (via drill 0.35)
  Top 0.2: U$3.61 20.5,32.5 20.5,32.75 20.75,33 24.75,33 v25,32.75 | U$10.3 41.12,26.61 42,27.5 42,29.75 41.25,30.5 37,30.5
  Top 0.25: 37,30.5 v34.25,30.5
  Bottom 0.2: v25,32.75 28,32.75 30.25,30.5 33.25,30.5
  Bottom 0.25: v34.25,30.5 33.5,30.5 33.25,30.5
CAN2_TX  (via drill 0.35)
  Top 0.2: U$3.62 20,33 20.5,33.5 v26,33.5 | U$10.2 41.13,27.89 41.5,28.25 41.5,29.5 41,30 34.5,30 34.25,29.75 33.5,29.75 33.25,30
  Top 0.25: 33.25,30 v33.25,31.25
  Bottom 0.2: v26,33.5 28,33.5 30.25,31.25 v33.25,31.25
CAN3_GND  (via drill 0.35)
  Top 0.2: U$9.5 46.75,40.09 | 46.75,40.09 46.97,40.09 C21.2 | 46.75,40.09 46.88,39.97 C19.2 47.1,37.27 U$6.8 47.1,37.35 47.25,37.5 v48.25,37.5 | C15.2 37.38,36.62 v37.25,36.75 | 41.87,34.63 U$6.2 41.87,34.63 | 41.87,34.63 v41.75,34.75 41.87,34.63
  Bottom 0.2: v37.25,36.75 37,36.75 | v41.75,34.75 41.5,34.75 | v48.25,37.5 48.5,37.5
  pour Bottom (isolate 0.254): 32.25,38.75 50.25,38.75 50.25,41.75 55,41.75 55,30.25 32.25,30.25
CAN3_H
  Top 0.2: U$6.7 49.03,34.63 R6.2 49.25,36.75 LEG3.P$1
CAN3_L
  Top 0.2: U$6.6 49.03,33.37 R6.1 50.65,33.15 LEG3.P$3
CAN3_RX  (via drill 0.35)
  Top 0.2: U$9.3 41.12,41.37 42.25,42.5 42.25,45 41.75,45.5 39.25,45.5 37.75,47 36.75,47 35.25,45.5
  Top 0.25: v29.75,44.25 29,45 U$1.33 | v33.75,45.5 35.25,45.5
  Bottom 0.25: v33.75,45.5 32.25,45.5 31,45.5 v29.75,44.25
CAN3_TX  (via drill 0.35)
  Top 0.2: U$9.2 41.38,42.63 41.75,43 41.75,44.5 41.25,45 38.5,45 v37.25,46.25
  Top 0.25: v29.75,45.5 U$1.34
  Bottom 0.25: v37.25,46.25 33,46.25 30.5,46.25 v29.75,45.5
CAN4_GND  (via drill 0.35)
  Top 0.2: U$11.5 45.16,54.59 v46,54 | U$7.8 47.1,52.27 C18.2 46.38,53.38 v46,54 | C22.2 45.62,54.88 v46,54 | U$7.2 42.12,49.88 v42,50 | C17.2 36.88,52.62 v36.75,52.75
  Bottom 0.2: v46,54 46.25,54 | v42,50 41.5,50 | v36.75,52.75 36.5,52.75
  pour Bottom (isolate 0.254): 32.5,54.25 38,54.25 38,55 55,55 54.75,46.5 32.25,46.5
CAN4_H
  Top 0.2: U$7.7 49.28,49.88 R7.2 50.1,50.1 50.75,50.75 50.75,53.25 51.5,54 LEG4.P$1
CAN4_L
  Top 0.2: U$7.6 48.78,48.62 R7.1 52.65,48.4 LEG4.P$3
CAN4_RX
  Top 0.2: U$11.3 41.62,55.87 42,56.25 42,59.25 41.5,59.75 31,59.75 30.5,59.25 24.5,59.25 24.25,59.5 23,59.5 21,57.5 21,56 20.5,55.5 U$1.61
CAN4_TX  (via drill 0.35)
  Top 0.2: 30.88,58.88 31.25,59.25 40,59.25 41.25,59.25 41.5,59 41.5,57.5 41.25,57.25 40.27,57.25 U$11.2
  Top 0.25: U$1.62 20,55.5 20.25,55.75 v20.25,56.75 | v23.75,58.75 30.75,58.75 30.88,58.88
  Bottom 0.25: v20.25,56.75 22.25,58.75 v23.75,58.75
CS1  (via drill 0.35)
  Top 0.2: U$3.20 20.5,28 v19.75,28.75 | v10,35.75 10,36 9.5,36.5 8,36.5 6.5,35 6.5,31.25 5.25,30 4,30 3.5,30.5 3.5,35.04 U$2.24
  Bottom 0.2: v19.75,28.75 16.25,28.75 16,29 11.5,29 10,30.5 10,34.5 v10,35.75
CS2  (via drill 0.35)
  Top 0.2: U$1.20 20.5,44.5 v19.5,45.5 | v10,38.75 6.25,38.75 5,37.5 3.58,37.5 U$2.26
  Bottom 0.2: v19.5,45.5 20.25,44.75 20.25,39.75 19.25,38.75 v10,38.75
  Bottom 0.25: U$2.26 2.23,38.77
ESTOP  (via drill 0.3)
  Top 0.2: U$3.36 29.25,23.5 v29.75,24 | v32.5,25.75 32.5,26 32.5,26.25 v32.5,39 32.5,38.75 | v32.5,40.75 32.5,41.5 32.5,41.75 32.5,47.5 | 32.5,47.5 32.5,53.25 v32.5,54 | v32.75,56.5 35.5,56.5 v37.5,58.5 | U$1.36 29.25,46.5 | 29.25,46.5 v29.75,47 29.25,46.5 | v33,47 32.5,47.5
  Bottom 0.2: v29.75,24 30.75,24 v32.5,25.75 | v32.5,39 32.5,39.25 32.25,39.5 32.25,40.5 v32.5,40.75 | v32.5,54 32.5,54.25 32.25,54.5 32.25,56 v32.75,56.5 | v37.5,58.5 ESTOP.P$2 | v29.75,47 v33,47
GND  (via drill 0.35)
  Top 0.2: v19,34.5 19.5,34 U$3.63 19.5,30.75 19.75,30.5 20.75,30.5 21,30.75 U$3.60 | U$11.4 38.78,54.59 C16.2 36.88,55.38 v36.75,55.25 | U$9.4 40.37,40.12 C14.2 37.12,40.12 v37,40 | U$10.4 39.03,25.34 C12.2 37.38,26.12 v37,25.75 | U$8.4 40.37,10.62 C8.2 36.88,10.62 v36.75,10.5
  Top 0.25: U$1.47 v29.5,52 | U$1.63 v19.5,56 | C3.2 17.53,57.08 C4.2 18.16,57.09 v18.5,57.25 | C5.2 29.29,56.46 v29.25,56.5 | U$1.12 v18.5,47 | C7.2 13.54,48.46 v12.75,49.25 | XT2.2 13.54,52.29 13.5,52.25 v12.75,52.25 | v19.5,41.25 U$1.18 19.5,41.11 C6.2 19.48,41.08 LED4.C | U$1.31 v26,44.5 | v19.5,17 U$3.18 19.5,18.15 C32.2 21.12,18 LED2.C | U$3.31 v26,21.25 | U$3.12 v18.25,24 | U$3.47 v27.25,29 | C31.2 29.46,33.71 v29.5,33.75 | C10.2 C27.2 18.85,34.35 v19,34.5 | C41.2 12.12,25.38 v12,25.5 | XT1.2 v12.6,29.9 12.75,29.75 | U$1.60 21,53 v21.25,52.75 | SER.3 10.5,21.75 10.5,21.5 v10,21 | SER1.3 10.38,45.38 v10.75,45.5 | PROG1.3 v7.75,55.5 | PROG.3 v8.25,31
  Top 0.406: C29.2 21.35,14.1 v21.25,14 | v28.5,13.5 28.25,13.5 C30.2 27.25,9.29 VR1.1
  Bottom 0.2: v36.75,55.25 36.25,55.25 36,55.5 | v37,40 36.25,40 | v37,25.75 36.75,25.5 | v36.75,10.5 36.25,10.5 36,10.25
  Bottom 0.25: v29.5,52 28.75,53.25 | v18.5,57.25 16.75,57.25 | v29.25,56.5 29.25,57 | v18.5,47 19,47 | v12.75,49.25 12,48.75 | v12.75,52.25 11.75,52.25 | v19.5,41.25 19.5,43.5 | v26,21.25 26,21.75 | v18.25,24 18.5,24 | v27.25,29 27,29 | v29.5,33.75 29.5,34 | v19,34.5 19,34.75 | v12,25.5 11.75,25.75 | v12.6,29.9 12.25,29.5 | v21.25,52.75 21.25,52.5 | v10,21 10,20.5 | v10.75,45.5 10,45 | v7.75,55.5 7.25,55.5 | v8.25,31 7.75,31
  Bottom 0.406: v21.25,14 20.75,13.5 | v28.5,13.5 29,12.5
  pour Bottom (isolate 0.254, rank 3): 0,85 56,85 56,0 0,0
INDICATOR1
  Top 0.25: U$3.25 R22.2
INDICATOR2
  Top 0.25: U$1.25 23,41.23 R4.2
L_5V
  Top 0.2: U$11.1 39.28,58.41 C16.1 37.38,57.12 35.5,55.25 33.52,55.25 DC4.2 | U$9.1 39.66,43.91 38.75,43 38.75,42.38 C14.1 38.12,42 37.5,42 35.52,40.02 DC3.2 31.98,40.02 31.5,40.5 | U$10.1 39.53,29.16 C12.1 37.88,27.88 34.75,24.75 33.52,24.75 DC2.2 31.52,24.77 | U$8.1 39.41,14.4 38.25,13.25 C8.1 36.62,12.38 34.25,10 33.52,10 DC1.2
  Top 0.25: 31.52,24.77 31.5,25.25
  Top 0.406: C29.1 22.25,9.29 VR1.3 | DC_IN.P$1 DC_IN.P$3
  Top 1.016: DC1.2 32.52,10.02 32.23,10.02 | 22.5,9.04 VR1.3 20.54,11 18.25,11 | DC_IN.P$1 16,14.25 16,11 18.25,11 | 32.23,10.02 31.5,10.75 | 31.5,10.75 31.5,25.25 31.5,40 31.5,40.5 31.5,55 | 31.5,55 31.5,55.25 | 31.5,55.25 31.5,55 | 31.5,55 31.5,55.25 | 31.5,55.25 33.48,55.25 DC4.2 | 32.23,10.02 32.23,9.73 | U$2.2 U$2.4 2.23,8.02 3.5,6.75 8.75,6.75 12,3.5 16,3.5 | 16,3.5 18.25,5.75 18.25,11 | 31.5,10.75 31.5,4.25 29,1.75 17.75,1.75 16,3.5
MC01
  Top 0.25: U$3.5 16.25,27.5 15.5,28.25 15.5,30 14.5,31 13.69,30.75 XT1.1
MC02
  Top 0.25: 17.25,50.5 U$1.5 16.25,50.5 15.5,51.25 15.5,52.75 14.76,53.49 XT2.1
MISO  (via drill 0.35)
  Top 0.2: U$3.22 v21.5,29.5 | v21.5,46.25 U$1.22 | U$2.21 4.77,34.77 7.5,37.5 12.25,37.5 20.25,37.5 20.5,37.25 20.75,37.25 | 20.75,37.25 21,37.25 | v21.5,37.25 20.75,37.25
  Bottom 0.2: v21.5,29.5 v21.5,37.25 v21.5,46.25
MOSI  (via drill 0.35)
  Top 0.2: U$1.23 22,44.5 | 22,44.5 v22.25,44.75 22,44.5 | U$3.23 22,28.5 v22.25,28.75 | U$2.19 4.77,32.27 6,33.5 6,35.25 7.75,37 12.25,37 20,37 20.75,36.25 21.75,36.25 v22.25,36.25
  Bottom 0.2: v22.25,28.75 v22.25,36.25 v22.25,44.75
N$2
  Top 0.25: U$3.13 14.92,23.5 CHOKE.2 C41.1
N$3
  Top 0.25: U$3.30 C9.2
N$4
  Top 0.25: U$1.13 15.26,46.5 CHOKE1.2 15.06,48.62 C7.1
N$5
  Top 0.25: U$1.30 25.5,41.37 C2.2
N$6
  Top 0.2: C1.1 45.5,9 44.5,8 44.5,4.75 45.5,3.75 46.45,3.75 U$4.5
N$7
  Top 0.25: LED4.A 22.79,39.32 R4.1
N$8
  Top 0.25: U$1.6 16,50 15,51 13.68,51 XT2.3
N$9
  Top 0.2: U$7.3 42.28,48.5 41.5,48.5 41,49 41,50.25 | 41,50.25 41,52.25 42.5,53.75 42.5,58.25 42.66,58.41 U$11.8 45.01,58.25 46.25,58.25 47,57.5 C22.1 | DC4.4 38,50.19 | 38,50.19 40.94,50.19 41,50.25 | C17.1 38,50.19
N$10
  Top 0.2: C20.1 45.38,18.12 45.75,17.75 46.76,17.75 U$5.5
N$11
  Top 0.2: 41,34.75 41,36.75 42.75,38.5 42.75,41.75 44.91,43.91 U$9.8 45.26,43.75 46,43.75 47.25,42.5 C21.1 | 41,34.75 41,33.75 41.5,33.25 42.28,33.25 U$6.3 | DC3.4 37.69,34.94 C15.1 40.88,34.88 41,34.75
N$12
  Top 0.2: 40.88,4.88 40.5,5.25 40.5,8.25 42.75,10.5 42.75,13.5 43.66,14.4 U$8.8 45.2,14.5 46,14.5 47.25,13.25 C24.1 | 40.88,4.88 41,4.75 41.78,4.75 U$4.3 | DC1.4 38.44,4.94 C11.1 40.88,4.88
N$14
  Top 0.2: U$8.7 43.88,13.13 43.25,12.5 43.25,8 42.75,7.5 41.99,7.5 U$4.1
N$15
  Top 0.2: U$11.7 43.63,57.13 43,56.5 43,53.5 42.25,52.75 42.25,51.3 U$7.1
N$16
  Top 0.2: U$8.6 45.13,11.87 45.25,11.75 44,11.75 43.75,11.5 43.75,4 43.25,3.5 41.99,3.5 U$4.4
N$17
  Top 0.2: U$11.6 44.12,55.87 43.5,55.25 43.5,52.25 44,51.75 44,47.75 43.5,47.25 42.49,47.25 U$7.4
N$18
  Top 0.2: U$7.5 45.91,47.34 45.25,48 45.25,52.62 C18.1
N$19
  Top 0.2: 40.75,19.25 40.75,22.25 42,23.5 42,26.5 42.75,27.25 42.75,28.5 43.41,29.16 U$10.8 45.01,29 46,29 47,28 C23.1 | 40.75,19.25 41,19 42.03,19 U$5.3 | 40.75,19.25 40.38,19.62 C13.1 38.44,19.69 DC2.4
N$20
  Top 0.2: U$10.7 44.13,27.89 43,26.75 43,22.5 U$5.1
N$21
  Top 0.2: U$10.6 44.12,26.61 43.5,26 43.5,18 43.25,17.75 42.24,17.75 U$5.4
N$22
  Top 0.2: C19.1 45.12,32.88 46,32 47.01,32 U$6.5
N$26
  Top 0.2: U$9.7 44.38,42.63 43.25,41.5 43.25,36.76 U$6.1
N$27
  Top 0.2: U$9.6 44.37,41.37 43.75,40.75 43.75,32.25 43.5,32 42.49,32 U$6.4
N$28
  Top 0.25: LED2.A 22.97,16.37 R22.1
N$30
  Top 0.25: U$3.6 16,27 15.25,27.75 14.75,28.25 13.39,28.25 XT1.3
NRST1  (via drill 0.35)
  Top 0.25: U$3.7 15.25,26.5 v15,26.75 | v8.25,29 PROG.5
  Bottom 0.25: v15,26.75 8.5,26.75 8.25,27 v8.25,29
NRST2  (via drill 0.35)
  Top 0.25: U$1.7 15.5,49.5 v14.75,50 | v7.75,53.5 PROG1.5
  Bottom 0.25: v14.75,50 9,50 7.75,51.25 v7.75,53.5
SCK  (via drill 0.35)
  Top 0.2: v20.75,45.5 21,45.25 U$1.21 | U$3.21 21,28.5 v20.75,28.75 | U$2.23 5.06,36.31 6.75,38 12.5,38 19.25,38 | 19.25,38 19.5,38 | v20.75,38 19.25,38
  Bottom 0.2: v20.75,45.5 v20.75,38 20.75,29 v20.75,28.75
SWO1  (via drill 0.35)
  Top 0.25: PROG.6 v9,28 | v23.5,27 U$3.55
  Bottom 0.25: v9,28 10.25,28 11,27.25 14.25,27.25 14.5,27.5 15.25,27.5 16,26.75 23.25,26.75 v23.5,27
SWO2  (via drill 0.35)
  Top 0.25: PROG1.6 8.75,52.5 v8.5,52.5 | v23.5,51.5 U$1.55
  Bottom 0.25: v8.5,52.5 8.5,51.25 9.25,50.5 14,50.5 14.5,51 23,51 v23.5,51.5
TCK1  (via drill 0.35)
  Top 0.25: PROG.2 9,32 v8.75,32 | v26,29 26.5,29.5 26.5,30 U$3.49
  Bottom 0.25: v8.75,32 9.5,31.25 9.5,29.5 10,29 10.75,29 11.5,28.25 13.75,28.25 14,28.5 15.75,28.5 16.5,27.75 22.5,27.75 23,28.25 23.75,28.25 24.5,29 v26,29
TCK2  (via drill 0.35)
  Top 0.25: PROG1.2 v8.5,56.5 | v26.75,52.75 26.75,53.5 26.5,53.75 U$1.49
  Bottom 0.25: v8.5,56.5 8.5,56 9.5,55 9.5,53.25 11.25,51.5 13.5,51.5 14,52 22.25,52 23,52.75 v26.75,52.75
TMS1  (via drill 0.35)
  Top 0.25: PROG.4 v8.75,30 | v25.25,28.25 27.5,28.25 27.75,28.5 U$3.46
  Bottom 0.25: v8.75,30 8.75,29.5 9.75,28.5 10.5,28.5 11.25,27.75 14,27.75 14.25,28 15.5,28 16.25,27.25 22.75,27.25 23.25,27.75 24.75,27.75 v25.25,28.25
TMS2  (via drill 0.35)
  Top 0.25: PROG1.4 v8.5,54.5 | v26.75,51.5 U$1.46
  Bottom 0.25: v8.5,54.5 8.5,53.5 11,51 13.75,51 14.25,51.5 22.5,51.5 23.25,52.25 26,52.25 v26.75,51.5
USART1_RX
  Top 0.25: SER.2 11.25,22.75 11.75,22.25 11.75,19.75 12.5,19 18.75,19 19,19.25 U$3.17
USART1_TX
  Top 0.25: SER.1 11,23.75 12.25,22.5 12.25,20 12.75,19.5 16.75,19.5 17,19.75 U$3.16
USART2_RX
  Top 0.25: SER1.2 11,47.25 11.75,46.5 11.75,44 12,43.75 15.75,43.75 17,42.5 18.5,42.5 U$1.17
USART2_TX
  Top 0.25: SER1.1 11.25,48.25 12.25,47.25 12.25,44.5 12.5,44.25 16.75,44.25 17,44.5 U$1.16
XBEE_RX  (via drill 0.35)
  Top 0.254: U$2.8 2.74,15.99 4,17.25 5.25,17.25 6.25,18.25 v6.25,26.5 | v5.75,42.75 5.75,43.25 6,43.5 6,60.5 9.5,64 13.75,64 15,62.75 JP1.3
  Bottom 0.254: v6.25,26.5 6.25,28.75 6.25,29 6.75,29.5 6.75,37.75 7,38 7,42 6.25,42.75 v5.75,42.75
XBEE_TX  (via drill 0.35)
  Top 0.25: U$2.10 2.53,18.53 3.5,19.5 3.5,27 3.75,27.25 | 6.5,60.25 6.75,60.5 9.75,63.5 12.25,63.5 13,62.75 JP1.2
  Top 0.254: 3.75,27.25 5.5,27.25 6,27.75 v6,29.75 | v6.25,41.25 6.25,42 6.5,42.25 6.5,60.25 6.75,60.5
  Bottom 0.2: v6,29.75 6.25,30 v6.25,41.25

### Text on the board
tNames: mini cheetah / SPIne V1.1 / ben katz / 2/18 | + | -